# EAGLE design scrump (EAGLE 7.7.0)
CNAME: Tschrump Weather Station; DESIGNER: Emre Elmas

## Sheet 1 of 2: uC
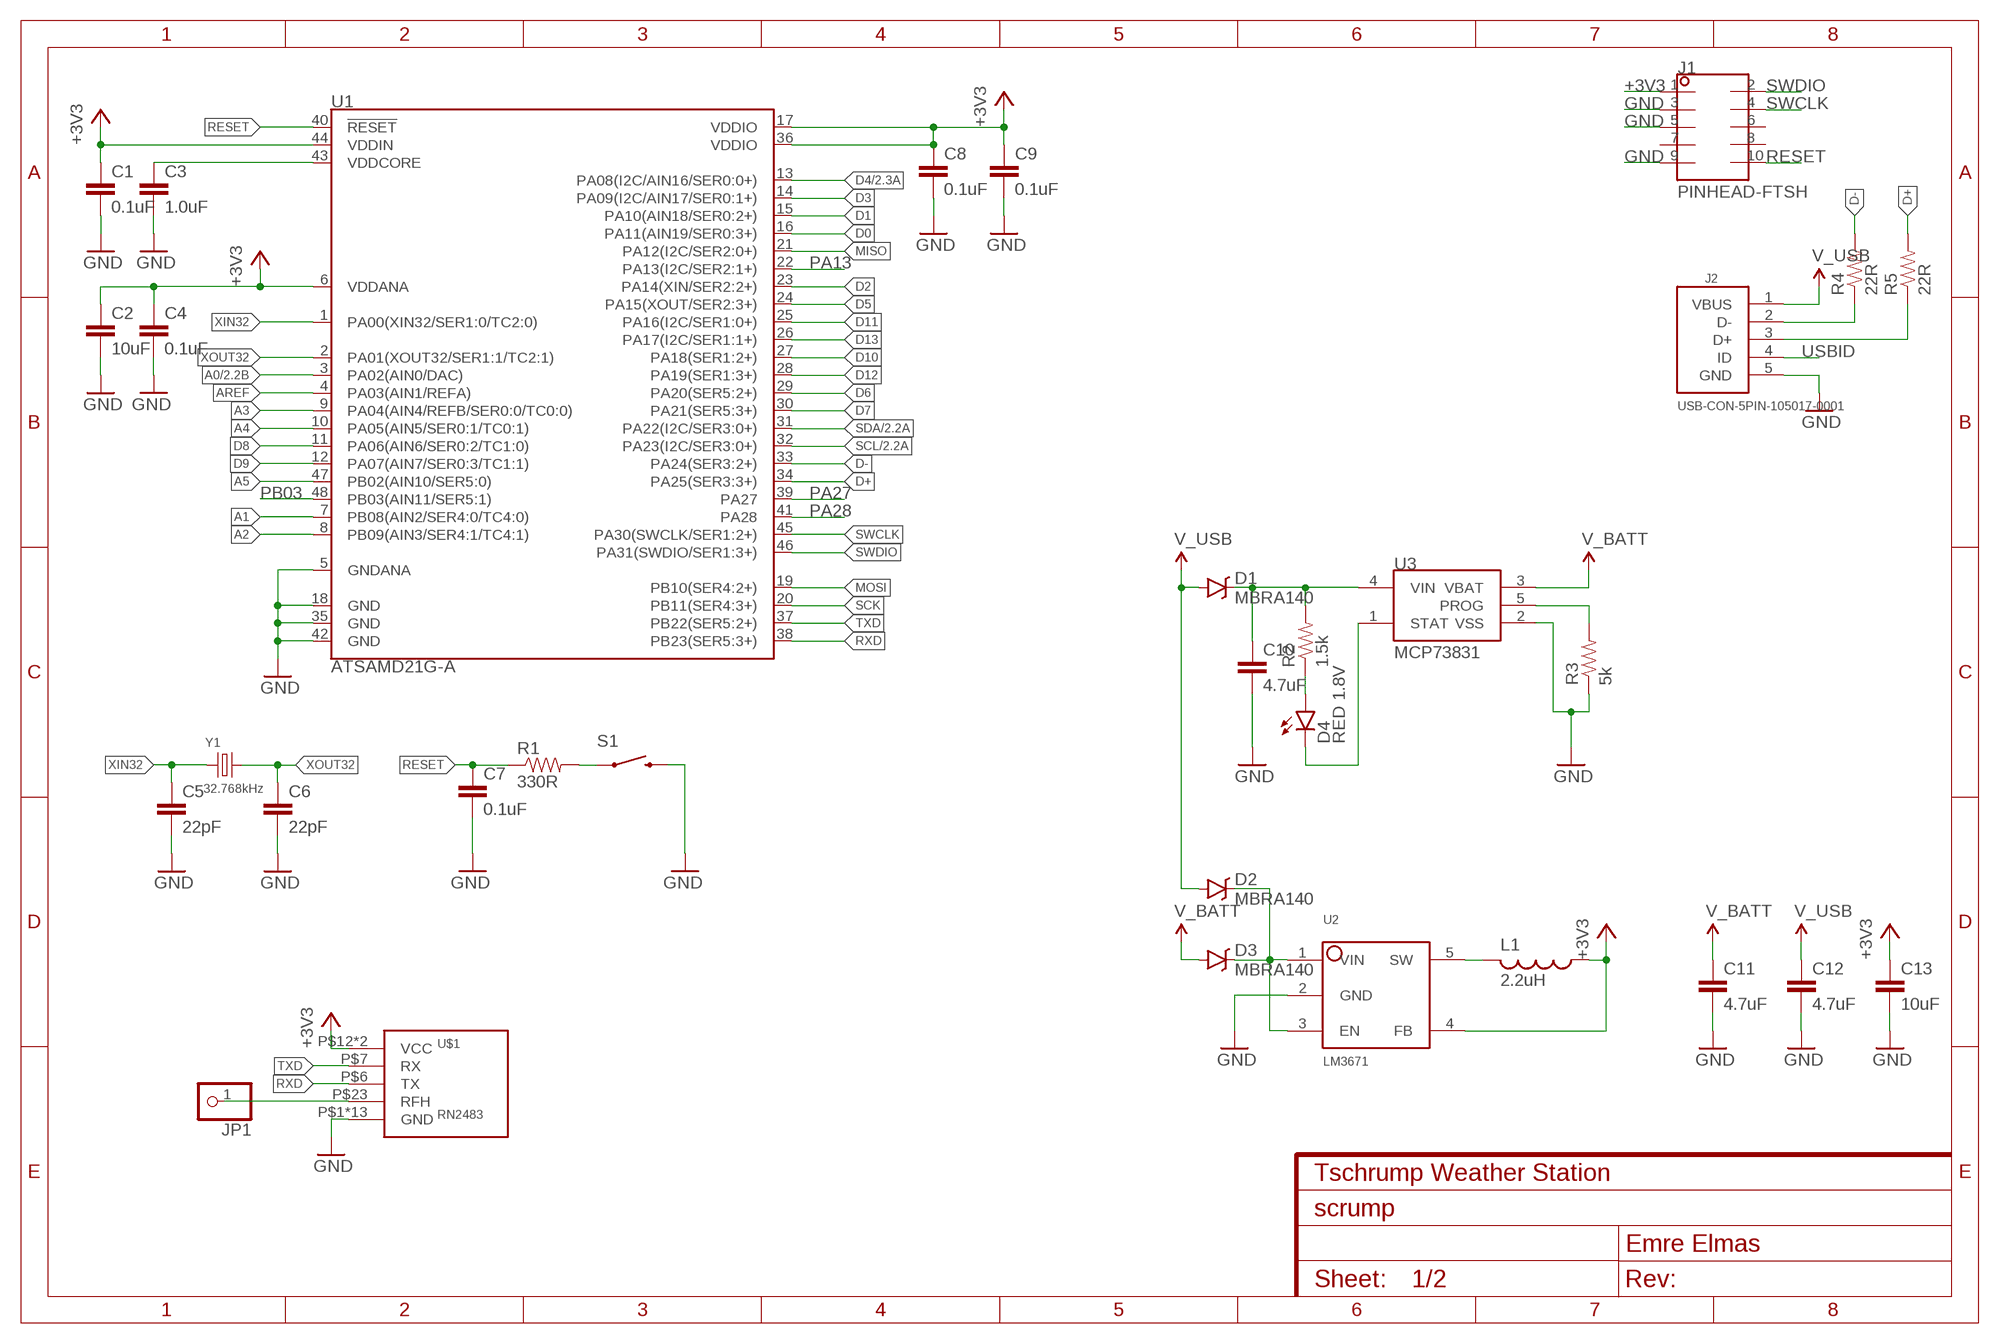
[diagram p0: schematic, sheet 1]

### Parts
C1  0.1uF  CAP0603-CAP  [0603-CAP]
C2  10uF  CAP0603-CAP  [0603-CAP]
C3  1.0uF  CAP0603-CAP  [0603-CAP]
C4  0.1uF  CAP0603-CAP  [0603-CAP]
C5  22pF  CAP0603-CAP  [0603-CAP]
C6  22pF  CAP0603-CAP  [0603-CAP]
C7  0.1uF  0.1UF-25V(+80/-20%)(0603)  [0603-CAP]
C8  0.1uF  CAP0603-CAP  [0603-CAP]
C9  0.1uF  CAP0603-CAP  [0603-CAP]
C10  4.7uF  CAP0603-CAP  [0603-CAP]
C11  4.7uF  CAP0603-CAP  [0603-CAP]
C12  4.7uF  CAP0603-CAP  [0603-CAP]
C13  10uF  CAP0603-CAP  [0603-CAP]
D1  MBRA140  [SMA-DIODE]
D2  MBRA140  [SMA-DIODE]
D3  MBRA140  [SMA-DIODE]
D4  RED 1.8V  LED-RED0603  [LED-0603]
J1  PINHEAD-FTSH  [FTSH-105-01-XXX-DV-K]
J2  USB-CON-5PIN-105017-0001  [USB-MICRO-MOLEX-105017-0001]
JP1  PINHD-1X1  [1X01]
L1  2.2uH  INDUCTOR  [0806-INDUCTOR]
R1  330R  RESISTOR0603  [0603-RES]
R2  1.5k  RESISTOR0603  [0603-RES]
R3  5k  RESISTOR0603  [0603-RES]
R4  22R  RESISTOR0603  [0603-RES]
R5  22R  RESISTOR0603  [0603-RES]
S1  PUSHBUTTON-SMD  [TACTILE-SMD-SWITCH]
U1  ATSAMD21G-A  [TQFP-48]
U2  LM3671  [SOT23-5]
U3  MCP73831  [SOT23-5]
U$1  RN2483  [RN2483]
Y1  32.768kHz  CRYSTAL  [ABS25]

### Nets
+3V3: C1.1 C2.1 C4.1 C8.1 C9.1 C13.1 J1.1 L1.1 U1.6(VDDANA) U1.17(VDDIO) U1.36(VDDIO) U1.44(VDDIN) U2.4(FB) U$1.P$12(VCC) U$1.P$34(VCC) ; also sheet 2
A0: U1.3(PA02(AIN0/DAC)) ; also sheet 2
A1: U1.7(PB08(AIN2/SER4:0/TC4:0))
A2: U1.8(PB09(AIN3/SER4:1/TC4:1))
A3: U1.9(PA04(AIN4/REFB/SER0:0/TC0:0))
A4: U1.10(PA05(AIN5/SER0:1/TC0:1))
A5: U1.47(PB02(AIN10/SER5:0))
AREF: U1.4(PA03(AIN1/REFA))
D0: U1.16(PA11(AIN19/SER0:3+))
D1: U1.15(PA10(AIN18/SER0:2+))
D2: U1.23(PA14(XIN/SER2:2+))
D3: U1.14(PA09(I2C/AIN17/SER0:1+))
D4: U1.13(PA08(I2C/AIN16/SER0:0+)) ; also sheet 2
D5: U1.24(PA15(XOUT/SER2:3+))
D6: U1.29(PA20(SER5:2+))
D7: U1.30(PA21(SER5:3+))
D8: U1.11(PA06(AIN6/SER0:2/TC1:0))
D9: U1.12(PA07(AIN7/SER0:3/TC1:1))
D10: U1.27(PA18(SER1:2+))
D11: U1.25(PA16(I2C/SER1:0+))
D12: U1.28(PA19(SER1:3+))
D13: U1.26(PA17(I2C/SER1:1+))
D+: R5.2 U1.34(PA25(SER3:3+))
D-: R4.2 U1.33(PA24(SER3:2+))
GND: C1.2 C2.2 C3.2 C4.2 C5.2 C6.2 C7.2 C8.2 C9.2 C10.2 C11.2 C12.2 C13.2 J1.3 J1.5 J1.9 J2.5(GND) R3.1 S1.P$3 S1.P$4 U1.5(GNDANA) U1.18(GND) U1.35(GND) U1.42(GND) U2.2(GND) U3.2(VSS) U$1.P$1(GND) U$1.P$8(GND) U$1.P$11(GND) U$1.P$20(GND) U$1.P$21(GND) U$1.P$22(GND) U$1.P$24(GND) U$1.P$26(GND) U$1.P$27(GND) U$1.P$28(GND) U$1.P$33(GND) U$1.P$41(GND) U$1.P$47(GND) ; also sheet 2
MISO: U1.21(PA12(I2C/SER2:0+))
MOSI: U1.19(PB10(SER4:2+))
N$1: C3.1 U1.43(VDDCORE)
N$2: R1.2 S1.P$1 S1.P$2
N$3: C10.1 D1.C R2.2 U3.4(VIN)
N$4: J2.3(D+) R5.1
N$5: L1.2 U2.5(SW)
N$6: D4.C U3.1(STAT)
N$7: D4.A R2.1
N$8: R3.2 U3.5(PROG)
N$9: J2.2(D-) R4.1
N$10: D2.C D3.C U2.1(VIN) U2.3(EN)
N$11: JP1.1 U$1.P$23(RFH)
PA13: U1.22(PA13(I2C/SER2:1+))
PA27: U1.39(PA27)
PA28: U1.41(PA28)
PB03: U1.48(PB03(AIN11/SER5:1))
RESET: C7.1 J1.10 R1.1 U1.40(!RESET!)
RXD: U1.38(PB23(SER5:3+)) U$1.P$6(TX)
SCK: U1.20(PB11(SER4:3+))
SCL: U1.32(PA23(I2C/SER3:0+)) ; also sheet 2
SDA: U1.31(PA22(I2C/SER3:0+)) ; also sheet 2
SWCLK: J1.4 U1.45(PA30(SWCLK/SER1:2+))
SWDIO: J1.2 U1.46(PA31(SWDIO/SER1:3+))
TXD: U1.37(PB22(SER5:2+)) U$1.P$7(RX)
USBID: J2.4(ID)
V_BATT: C11.1 D3.A U3.3(VBAT)
V_USB: C12.1 D1.A D2.A J2.1(VBUS)
XIN32: C5.1 U1.1(PA00(XIN32/SER1:0/TC2:0)) Y1.P$1
XOUT32: C6.1 U1.2(PA01(XOUT32/SER1:1/TC2:1)) Y1.P$4
Unconnected: J1.6 J1.7 J1.8

## Sheet 2 of 2: Sensors
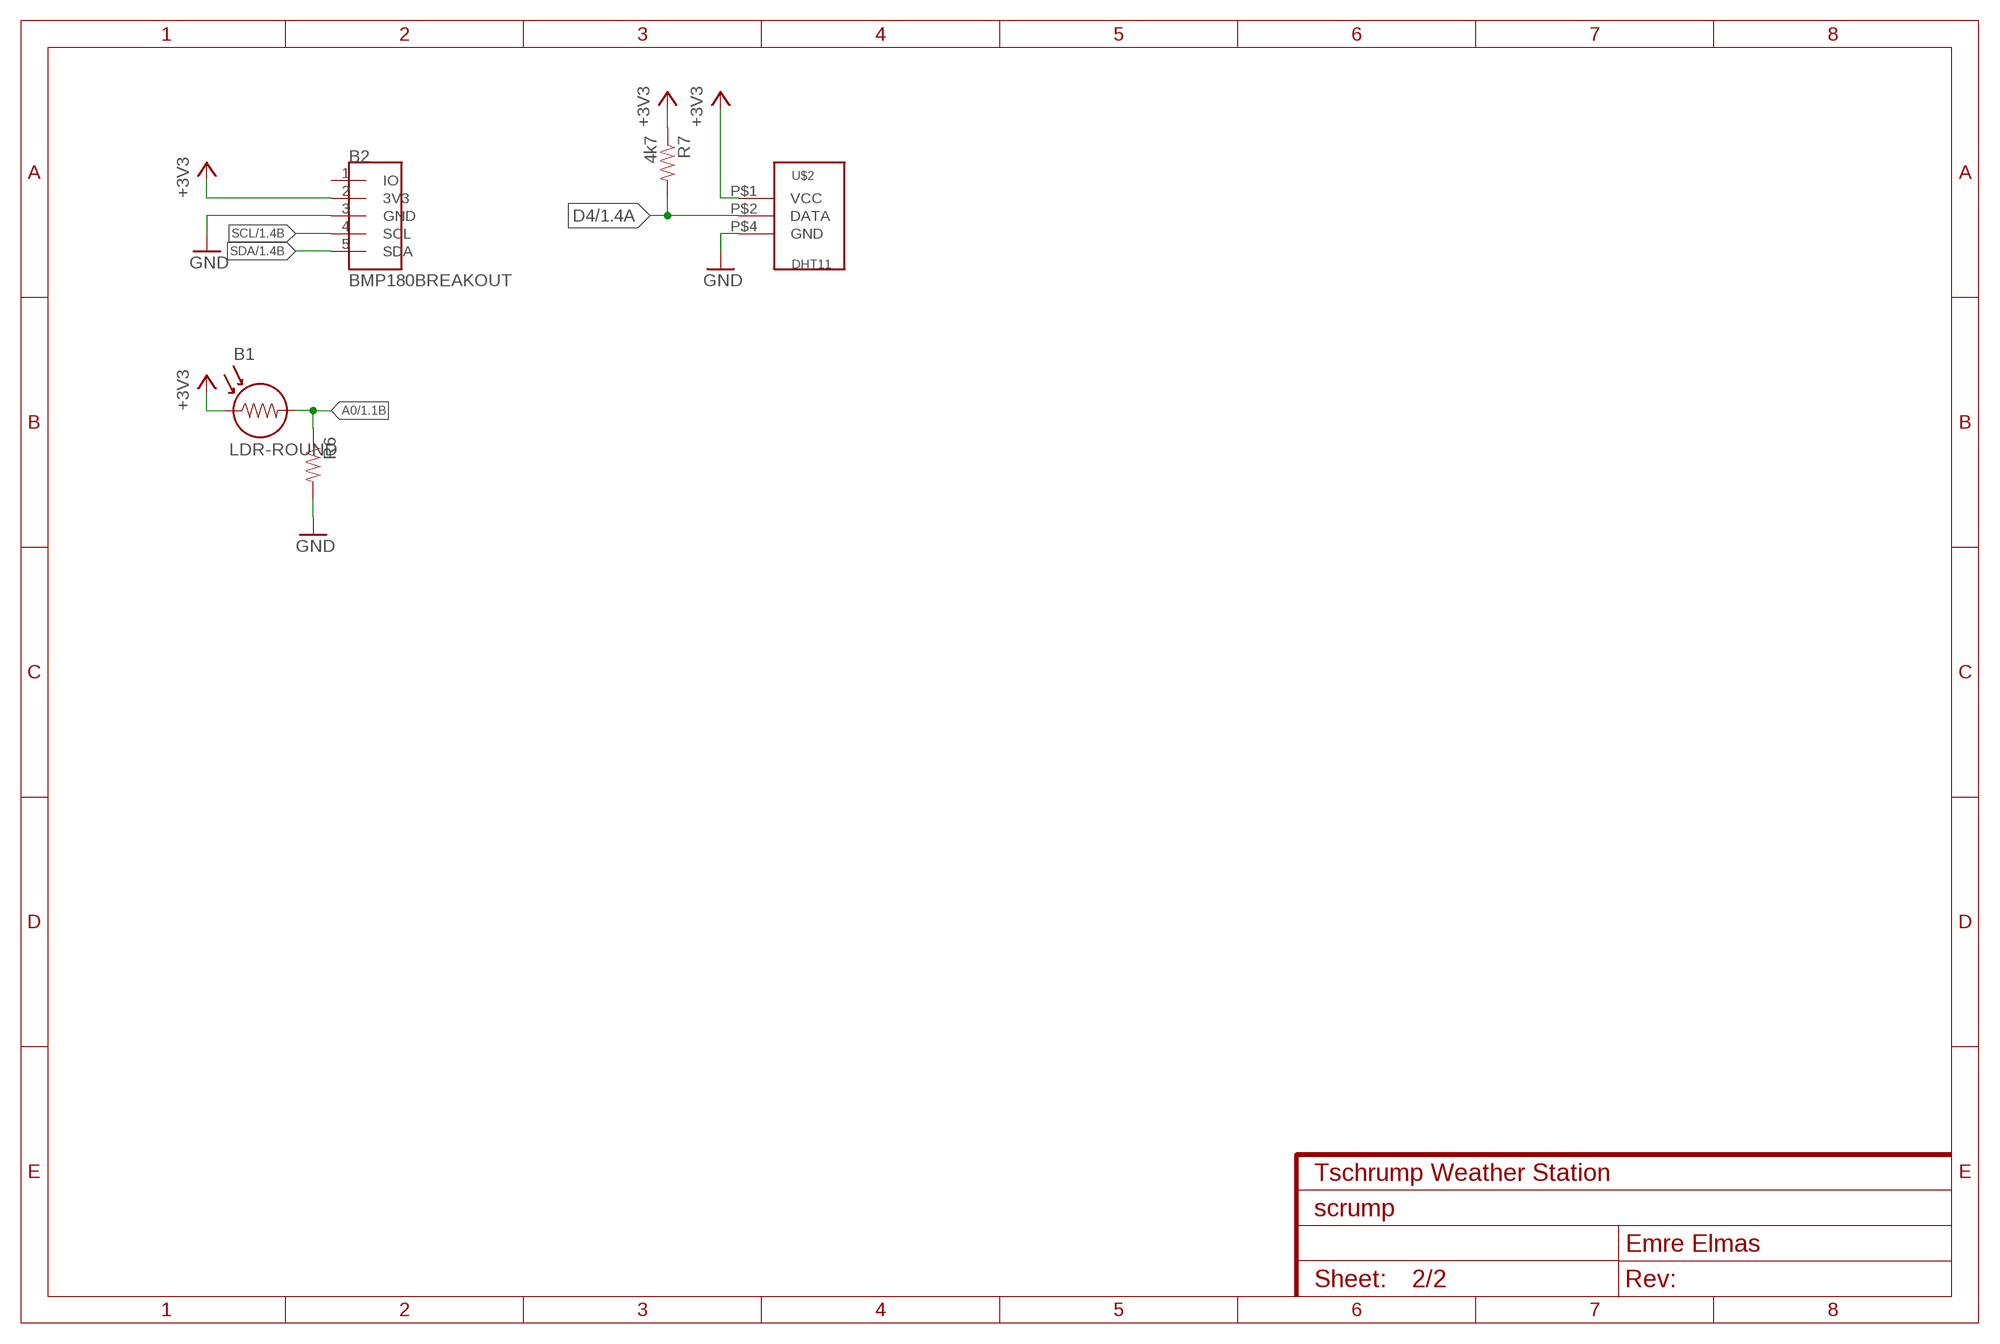
[diagram p1: schematic, sheet 2]

### Parts
B1  LDR-ROUND  [LDR-ROUND]
B2  BMP180BREAKOUT  [BMP180_BREAKOUT]
R6  RESISTOR0603  [0603-RES]
R7  4k7  RESISTOR0603  [0603-RES]
U$2  DHT11  [DHT11]

### Nets
+3V3: B1.P$1 B2.2(3V3) R7.1 U$2.P$1(VCC) ; also sheet 1
A0: B1.P$2 R6.1 ; also sheet 1
D4: R7.2 U$2.P$2(DATA) ; also sheet 1
GND: B2.3(GND) R6.2 U$2.P$4(GND) ; also sheet 1
SCL: B2.4(SCL) ; also sheet 1
SDA: B2.5(SDA) ; also sheet 1
Unconnected: B2.1(IO)

## Library data of the parts
B1 = mylibrary:LDR-ROUND
B2 = mylibrary:BMP180
C1-C6 C8-C13 = SparkFun-Capacitors:CAP: Capacitor Standard 0603 ceramic capacitor, and 0.1" leaded capacitor.
C7 = SparkFun-Capacitors:0.1UF-25V(+80/-20%)(0603): CAP-00810 Ceramic Standard decoupling cap; PROD_ID: CAP-00810
D1-D3 = SparkFun-DiscreteSemi:MBRA140: 40V, 1A Schottky rectifier SMA/DO-214AC package DIO-08053; PROD_ID: DIO-08053
D4 = SparkFun-LED:LED-RED: Assorted Red LEDs LilyPad 1206- DIO-09912 1206- DIO-00809 0603- DIO-00819 "SMART" means more efficient and expensive; PROD_ID: DIO-00819; VALUE: RED
J1 = mylibrary:PINHEAD-FTSH
J2 = mylibrary:USB-CON-5PIN: Molex Micro USB 105017-0001
JP1 = pinhead:PINHD-1X1: PIN HEADER
L1 = mylibrary:INDUCTOR
R1-R7 = SparkFun-Resistors:RESISTOR: Resistor Basic schematic elements and footprints for 0603, 1206, and PTH resistors.
S1 = mylibrary:PUSHBUTTON-SMD
U1 = SparkFun-DigitalIC:ATSAMD21G: Atmel SAMD21G SMART ARM-Based Microcontroller The Atmel ® | SMART ™ SAM D21 is a series of low-power microcontrollers using the 32-bit ARM ® Cortex ® -M0+ processor, and ranging from 32- to 64-pins with up to 256KB Flash and 32KB of SRAM. The SAM D21 devices operate at a maximum frequency of 48MHz and reach 2.46 CoreMark/MHz. They are designed for simple and intuitive migration with identical peripheral modules, hex compatible code, identical linear address map and pin compatible migration paths between all devices in the product series. All devices include intelligent and flexible peripherals, Atmel Event System for inter-peripheral signaling, and support for capacitive touch button, slider and wheel user interfaces.; PROD_ID: IC-13064
U2 = mylibrary:LM3671
U3 = mylibrary:MCP73831
U$1 = mylibrary:RN2483
U$2 = mylibrary:DHT11
Y1 = mylibrary:CRYSTAL

## Board
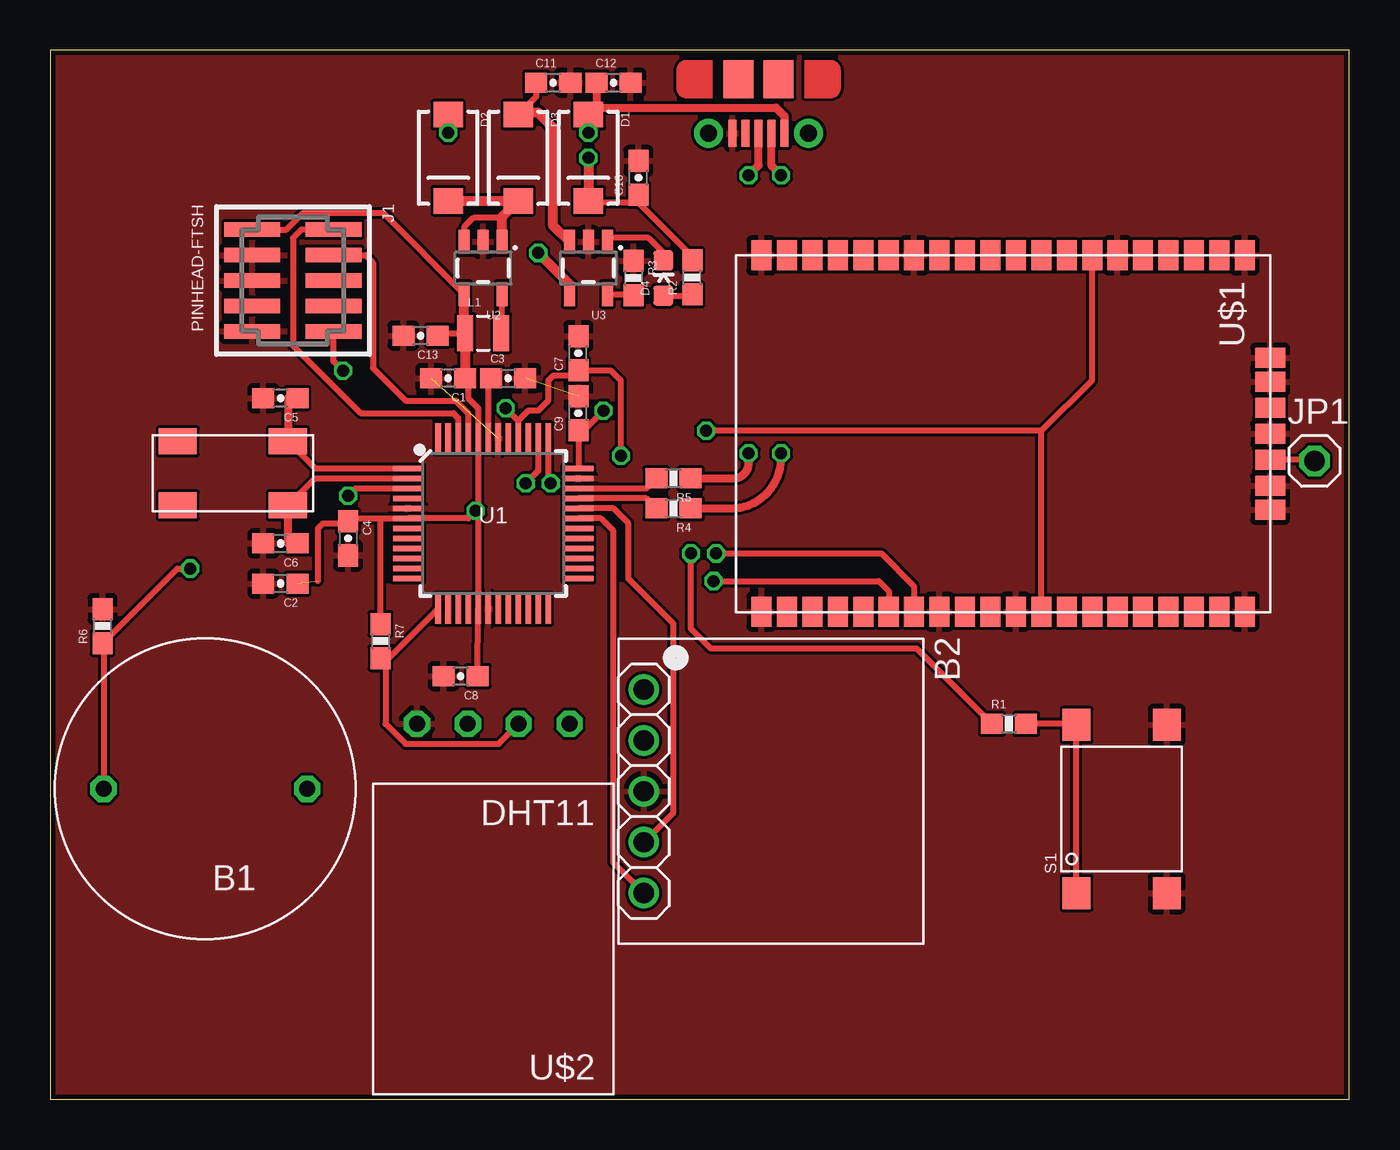
[diagram p2: board, top side]
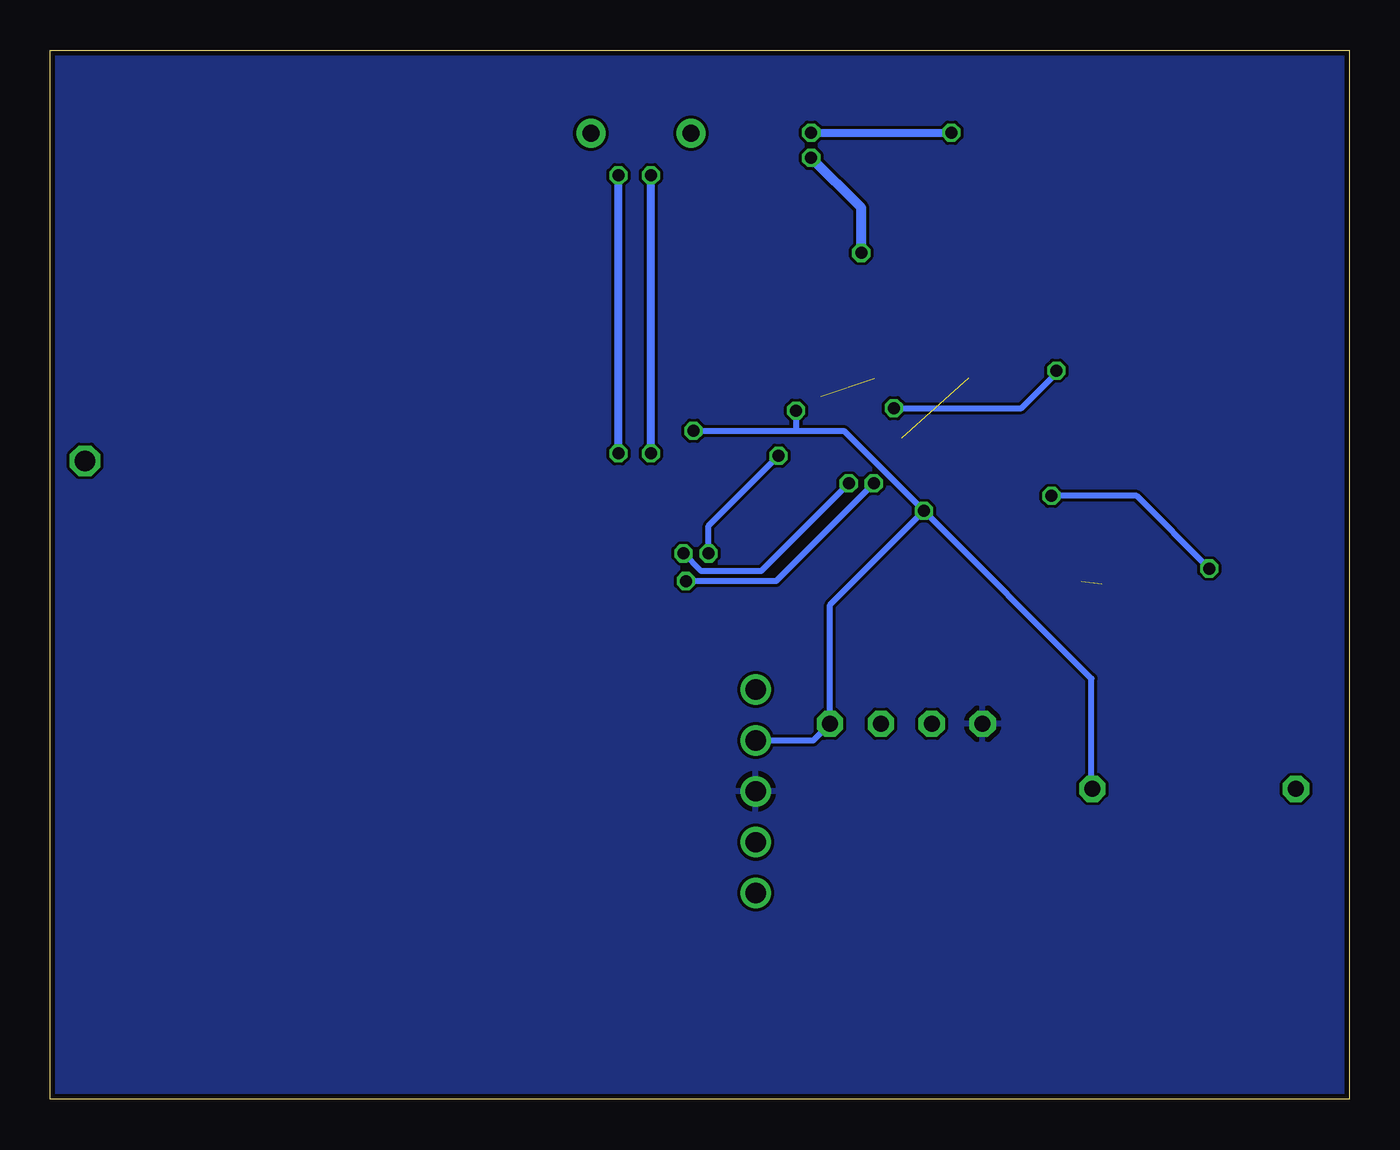
[diagram p3: board, bottom side, seen from below]

Size 64.88 x 52.38 mm. Coordinates in mm from the lower left corner, seen from the top.
Outline: 0,0 64.88,0 64.88,52.38 0,52.38 0,0
Copper layers (1*16): Top 0.035mm / dielectric 1.5mm / Bottom 0.035mm
Design rules "SeeedStudio_2layer_DRU_no_angle_20140221": minimum track width 6mil, minimum drill 12mil, track to track 6mil, track to pad 6mil, pad to pad 6mil, via to via 6mil, smd to smd 0mil, copper to edge 10mil, drill to drill 10mil, minimum pad ring 10mil, minimum via ring 6mil, stop-mask expansion 2mil, vias tented up to drill 100mil, thermal gap 10mil

### Footprints (pad centres in the part's own frame; a part is rotated, then mirrored left to right if it is on the bottom)
LDR-ROUND = drill 0.8 octagon: P$1 -5.08,0; P$2 5.08,0
BMP180_BREAKOUT = drill 1.016: 1 2.54,1.27; 2 5.08,1.27; 3 7.62,1.27; 4 10.16,1.27; 5 12.7,1.27
0603-CAP = smd 1.1 x 1: 1 -0.85,0; 2 0.85,0
SMA-DIODE = smd 1.27 x 1.47: A -2.15,0; C 2.15,0
LED-0603 = smd 1 x 1: A 0,-0.877; C 0,0.877
FTSH-105-01-XXX-DV-K = smd 0.737 x 2.794: 1 -2.54,-2.032; 2 -2.54,2.032; 3 -1.27,-2.032; 4 -1.27,2.032; 5 0,-2.032; 6 0,2.032; 7 1.27,-2.032; 8 1.27,2.032; 9 2.54,-2.032; 10 2.54,2.032
USB-MICRO-MOLEX-105017-0001 = smd 0.4 x 1.35: 1 1.2,0; 2 1.85,0; 3 2.5,0; 4 3.15,0; 5 3.8,0 | drill 0.85 pad 1.45: P$1 0,0; P$2 5,0 | smd 1.5 x 1.9: P$3 3.5,-2.7; P$4 1.5,-2.7
1X01 = drill 1.016 octagon: 1 0,0
0806-INDUCTOR = smd 0.8 x 1.8: 1 -0.9,0; 2 0.9,0
0603-RES = smd 1.1 x 1: 1 -0.85,0; 2 0.85,0
TACTILE-SMD-SWITCH = smd 1.6 x 1.4: P$1 -4.2,2.25; P$2 4.2,2.25; P$3 4.2,-2.25; P$4 -4.2,-2.25
TQFP-48 = smd 1.5 x 0.28: 1 -4.25,2.75; 2 -4.25,2.25; 3 -4.25,1.75; 4 -4.25,1.25; 5 -4.25,0.75; 6 -4.25,0.25; 7 -4.25,-0.25; 8 -4.25,-0.75; 9 -4.25,-1.25; 10 -4.25,-1.75; 11 -4.25,-2.25; 12 -4.25,-2.75; 25 4.25,-2.75; 26 4.25,-2.25; 27 4.25,-1.75; 28 4.25,-1.25; 29 4.25,-0.75; 30 4.25,-0.25; 31 4.25,0.25; 32 4.25,0.75; 33 4.25,1.25; 34 4.25,1.75; 35 4.25,2.25; 36 4.25,2.75 | smd 0.28 x 1.5: 13 -2.75,-4.25; 14 -2.25,-4.25; 15 -1.75,-4.25; 16 -1.25,-4.25; 17 -0.75,-4.25; 18 -0.25,-4.25; 19 0.25,-4.25; 20 0.75,-4.25; 21 1.25,-4.25; 22 1.75,-4.25; 23 2.25,-4.25; 24 2.75,-4.25; 37 2.75,4.25; 38 2.25,4.25; 39 1.75,4.25; 40 1.25,4.25; 41 0.75,4.25; 42 0.25,4.25; 43 -0.25,4.25; 44 -0.75,4.25; 45 -1.25,4.25; 46 -1.75,4.25; 47 -2.25,4.25; 48 -2.75,4.25
SOT23-5 = smd 0.55 x 1.2: 1 -0.95,-1.3; 2 0,-1.3; 3 0.95,-1.3; 4 0.95,1.3; 5 -0.95,1.3
RN2483 = smd 1.5 x 1: P$1 17.78,1.27; P$2 17.78,2.54; P$3 17.78,3.81; P$4 17.78,5.08; P$5 17.78,6.35; P$6 17.78,7.62; P$7 17.78,8.89; P$8 17.78,10.16; P$9 17.78,11.43; P$10 17.78,12.7; P$11 17.78,13.97; P$12 17.78,15.24; P$13 17.78,16.51; P$14 17.78,17.78; P$15 17.78,19.05; P$16 17.78,20.32; P$17 17.78,21.59; P$18 17.78,22.86; P$19 17.78,24.13; P$20 17.78,25.4; P$28 0,25.4; P$29 0,24.13; P$30 0,22.86; P$31 0,21.59; P$32 0,20.32; P$33 0,19.05; P$34 0,17.78; P$35 0,16.51; P$36 0,15.24; P$37 0,13.97; P$38 0,12.7; P$39 0,11.43; P$40 0,10.16; P$41 0,8.89; P$42 0,7.62; P$43 0,6.35; P$44 0,5.08; P$45 0,3.81; P$46 0,2.54; P$47 0,1.27 | smd 1 x 1.5: P$21 12.7,26.67; P$22 11.5,26.67; P$23 10.2,26.67; P$24 8.9,26.67; P$25 7.6,26.67; P$26 6.3,26.67; P$27 5.1,26.67
DHT11 = drill 0.8 octagon: P$1 -3.81,0; P$2 -1.27,0; P$3 1.27,0; P$4 3.81,0
ABS25 = smd 1.9 x 1.3: P$1 -2.75,-1.6; P$2 2.75,-1.6; P$3 2.75,1.6; P$4 -2.75,1.6

### Placement (x,y rotation side)
B1  7.75,15.5 180 top
B2  28.38,23 270 top
C1  19.88,36 180 top
C2  11.5,25.75 180 top
C3  22.88,36 0 top
C4  14.88,28 270 top
C5  11.5,35 180 top
C6  11.5,27.75 180 top
C7  26.38,37.25 90 top
C8  20.5,21.12 180 top
C9  26.38,34.25 90 top
C10  29.38,46 90 top
C11  25.12,50.75 0 top
C12  28.12,50.75 0 top
C13  18.5,38.12 180 top
D1  26.88,47 270 top
D2  19.88,47 270 top
D3  23.38,47 270 top
D4  30.62,41 0 top
J1  12.12,40.88 270 top
J2  37.88,48.23 180 top
JP1  63.12,31.88 0 top
L1  21.62,38.25 0 top
R1  47.88,18.75 0 top
R2  32.06,41.03 90 top
R3  29.12,41 270 top
R4  31.12,29.5 180 top
R5  31.12,31 180 top
R6  2.62,23.62 90 top
R7  16.5,22.88 270 top
S1  53.5,14.5 90 top
U1  22.12,28.75 0 top
U2  21.62,41.5 180 top
U3  26.88,41.5 180 top
U$1  34.25,42.12 270 top
U$2  22.12,18.75 180 top
Y1  9.12,31.25 180 top

### Tracks (layer width: path | path; a pad name or v marks a point on that pad's centre or on a via)
+3V3  (via drill 0.6)  (1 unrouted)
  Top 0.3: 13.38,25.88 13.38,28.5 13.62,28.75 14.78,28.75 C4.1 15.03,29 16.5,29 | 16.5,29 U1.6 20.88,29 v21.25,29.38 21.38,29.5 | C8.1 U1.17 21.38,29.5 | C1.1 20.88,35.85 20.88,35 21.38,34.5 U1.44 | 20.68,38.3 L1.1 19.73,38.25 C13.1 | U1.36 C9.1 26.65,33.4 v27.62,34.38 | U1.44 21.38,29.5 | U1.44 21.38,32 | R7.1 16.5,29 | 49.5,33.38 52.03,35.91 U$1.P$34 | U$1.P$12 49.5,24.36 49.5,33.38 | 49.5,33.38 v32.75,33.38 | J1.1 11.79,43.41 12.62,44.25 16.62,44.25 U2.4
  Top 0.5: 20.68,38.3 U2.4 | L1.1 C1.1
  Bottom 0.3: v21.25,29.38 25.93,24.69 U$2.P$1 26.77,17.92 B2.2 | v21.25,29.38 12.88,21 12.88,15.54 B1.P$1 | v32.75,33.38 27.62,33.38 | 27.62,33.38 25.25,33.38 v21.25,29.38 | v27.62,34.38 27.62,33.38
A0  (via drill 0.6)
  Top 0.3: B1.P$2 2.67,22.73 R6.1 6.35,26.5 v7,26.5 | v14.88,30.12 15.25,30.5 U1.3
  Bottom 0.3: v7,26.5 10.62,30.12 v14.88,30.12
D4
  Top 0.3: U1.13 16.75,21.88 | 16.75,21.88 16.75,18.75 17.75,17.75 22.39,17.75 U$2.P$2 | 16.75,21.88 16.6,22.02 R7.2
D+
  Top 0.3: U1.34 29.77,30.5 R5.2
D-
  Top 0.3: R4.2 29.77,30 U1.33
GND  (2 unrouted)
  pour Top: 0,0 64.88,0 64.88,52.38 0,52.38
  pour Bottom: 0,0 64.88,0 64.88,52.38 0,52.38
N$1
  Top 0.3: C3.1 21.88,35.85 U1.43
N$2
  Top 0.3: S1.P$1 S1.P$2 51.2,18.75 R1.2
N$3  (via drill 0.6)
  Top 0.3: R2.2 32.06,42.06 29.38,44.75 | 29.38,44.75 26.98,44.75 D1.C | 29.38,44.75 C10.1
  Top 0.5: U3.4 25.93,40.7 v24.38,42.25 | v26.88,47 D1.C
  Bottom 0.5: v24.38,42.25 24.38,44.5 v26.88,47
N$4  (via drill 0.6)
  Top 0.4: R5.1 34.12,31 arc90 34.88,31.75 v34.88,32.25 | v34.88,46.12 35.38,46.62 J2.3
  Bottom 0.4: v34.88,32.25 v34.88,46.12
N$5
  Top 0.3: L1.2 22.57,38.3 U2.5
N$6
  Top 0.3: D4.C 30.62,42.25 29.88,43 28.02,43 U3.1
N$7
  Top 0.3: D4.A 32.01,40.12 R2.1
N$8
  Top 0.3: U3.5 29.07,40.2 R3.2
N$9  (via drill 0.6)
  Top 0.4: R4.1 34,29.5 arc90 36.5,32 v36.5,32.25 | v36.5,46.12 36.02,46.6 J2.2
  Bottom 0.4: v36.5,32.25 v36.5,46.12
N$10
  Top 0.3: U2.1 22.57,44 21.12,44 20.68,43.55 U2.3
  Top 0.5: D2.C D3.C 22.57,44.05 U2.1
N$11
  Top 0.3: JP1.1 63.08,31.93 U$1.P$23
RESET  (via drill 0.6)
  Top 0.3: 23.38,33.88 23.88,34.38 24.38,34.38 24.88,34.88 24.88,35.88 25.12,36.12 26.1,36.12 C7.1 26.4,36.38 28,36.38 28.5,35.88 v28.5,32.12 | 23.38,33.88 U1.40 | 23.38,33.88 v22.75,34.5 | v14.62,36.38 14.16,36.84 J1.10 | R1.1 43.27,22.5 33,22.5 32,23.5 v32,27.25
  Bottom 0.3: v22.75,34.5 16.38,34.5 14.62,36.25 v14.62,36.38 | v32,27.25 32,28.62 v28.5,32.12
RXD  (via drill 0.6)
  Top 0.3: U1.38 24.38,31.38 v23.75,30.75 | v33.12,25.88 41.38,25.88 41.88,25.38 U$1.P$6
  Bottom 0.3: v23.75,30.75 28.62,25.88 v33.12,25.88
SCL
  Top 0.3: B2.4 31.12,14.32 31.12,23.75 28.88,26 28.88,28.75 28.12,29.5 U1.32
SDA
  Top 0.3: B2.5 28.12,11.82 28.12,28.38 27.5,29 U1.31
SWCLK
  Top 0.3: J1.4 15.73,42.15 16.12,41.75 16.12,36.5 17.75,34.88 20.25,34.88 20.88,34.25 U1.45
SWDIO
  Top 0.3: J1.2 12.54,43.41 12.12,43 12.12,37.62 15.5,34.25 20.12,34.25 20.38,34 U1.46
TXD  (via drill 0.6)
  Top 0.3: U1.37 24.88,30.88 v25,30.75 | v33.25,27.25 41.5,27.25 43.12,25.62 43.12,24.36 U$1.P$7
  Bottom 0.3: v25,30.75 29.38,26.38 32.38,26.38 v33.25,27.25
V_BATT
  Top 0.3: C11.1 24.27,50.05 D3.A
  Top 0.5: U3.3 25.12,43.6 25.12,48.5 24.38,49.25 23.48,49.25 D3.A
V_USB  (via drill 0.6)
  Top 0.4: C12.1 27.27,49.55 27.32,49.5 36.25,49.5 36.67,49.08 J2.1 | D1.A v26.88,48.25 | v19.88,48.25 D2.A
  Top 0.5: 27.27,49.55 D1.A
  Bottom 0.4: v26.88,48.25 v19.88,48.25
XIN32
  Top 0.3: Y1.P$1 13.22,31.5 U1.1
  Top 0.406: C5.1 11.88,35 Y1.P$1
XOUT32
  Top 0.3: Y1.P$4 13.22,31 U1.2
  Top 0.406: C6.1 11.88,27.75 Y1.P$4